# EAGLE design Adapter-CMRI8-RJ45 (EAGLE 7.7.0)
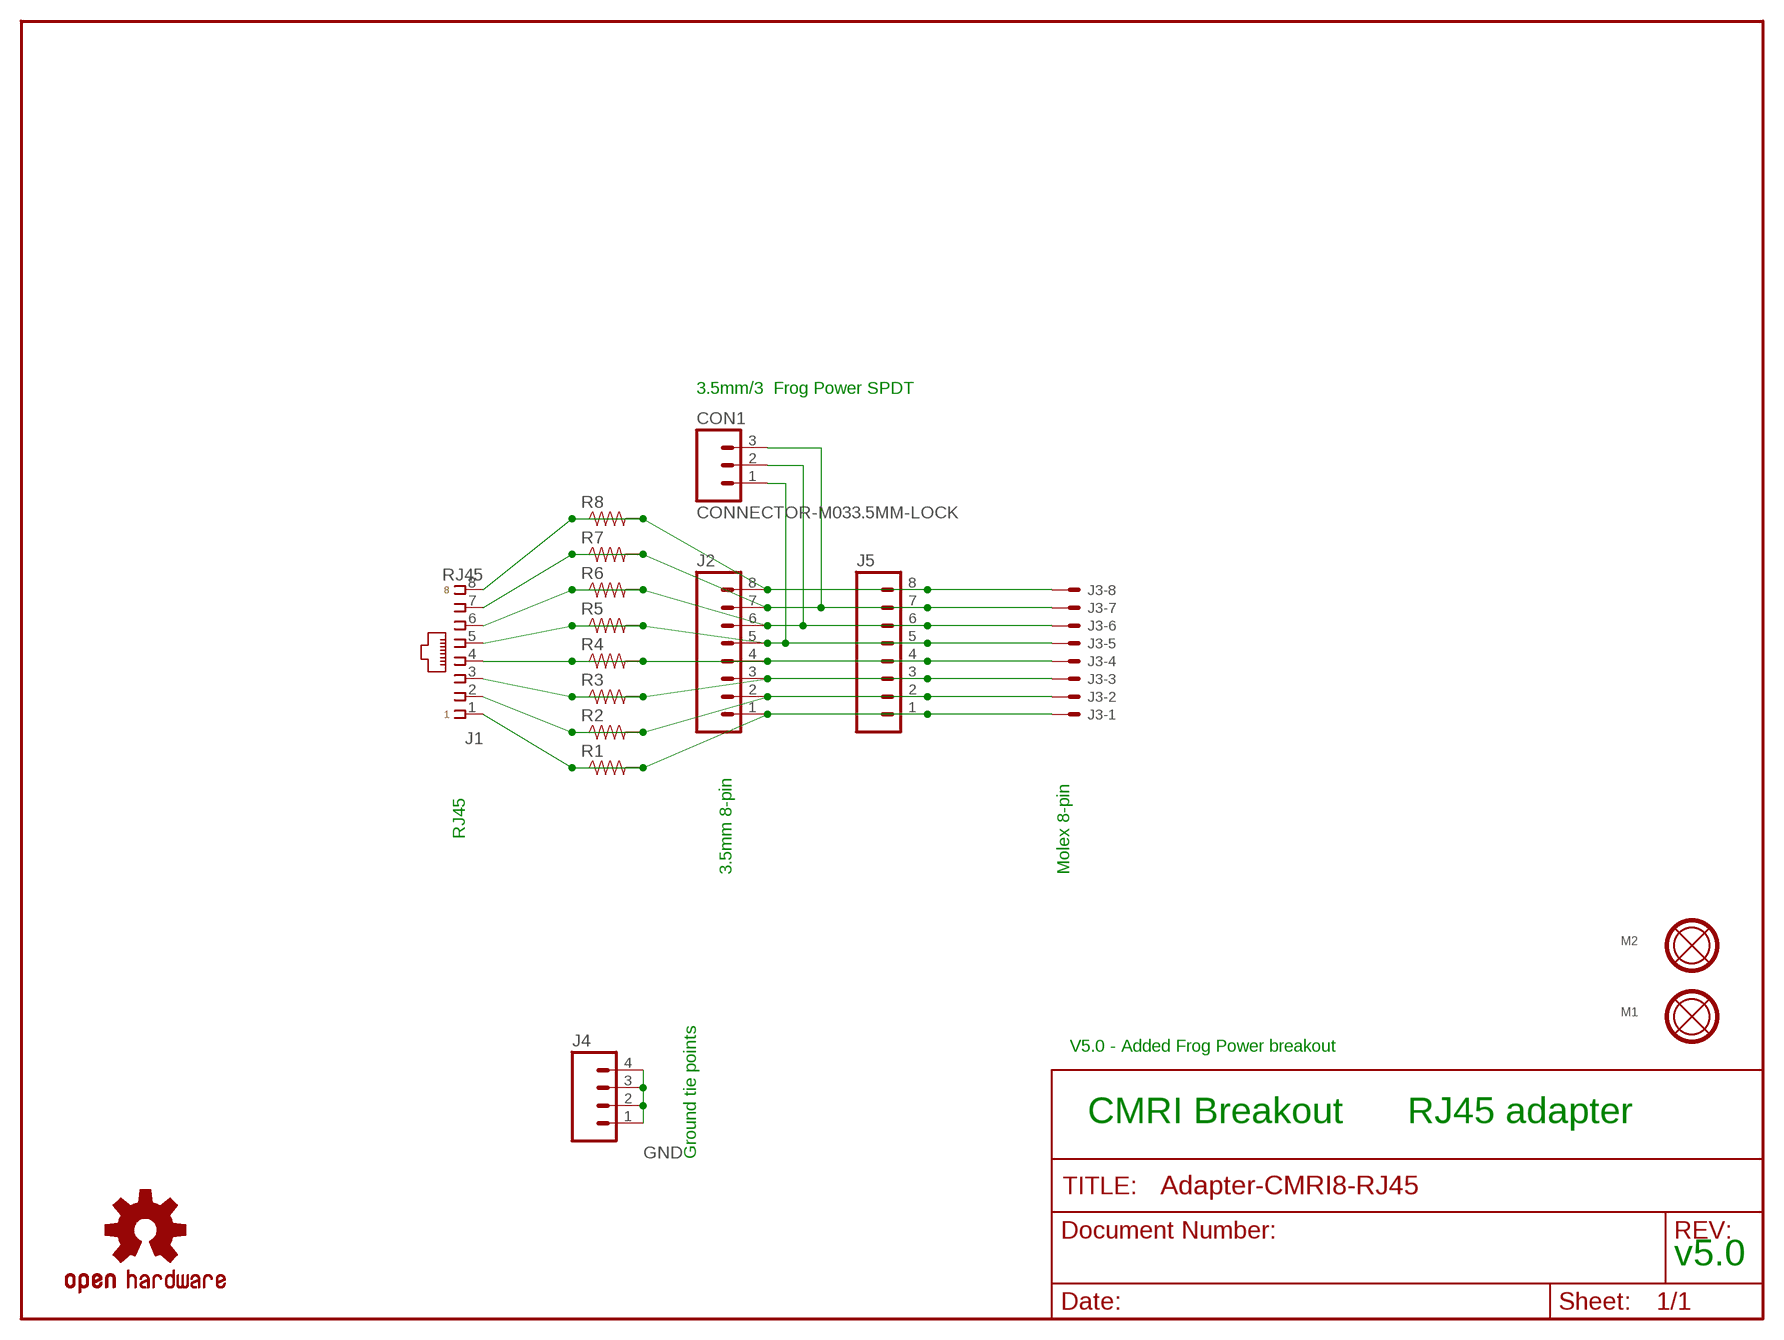
[diagram p0: schematic, sheet 1]

## Parts
CON1  CONNECTOR-M033.5MM-LOCK  [SCREWTERMINAL-3.5MM-3_LOCK.007S]
J1  RJ45  CONNECTOR-RJ45-FRONT  [RJ45-NO-SHIELD]
J2  CONNECTOR-M083.5MM-8  [SCREWTERMINAL-3.5MM-8]
J3  KK-156-8F  [KK-156-8-F]
J4  CONNECTOR-M04SCREW_LOCK  [SCREWTERMINAL-3.5MM-4_LOCK]
J5  CONNECTOR-M08LOCK  [1X08_LOCK]
M1  MOUNTINGHOLE  [MOUNTINGHOLE]
M2  MOUNTINGHOLE  [MOUNTINGHOLE]
R1  RPTH04  [AXIAL-0.4-RES]
R2  RPTH04  [AXIAL-0.4-RES]
R3  RPTH04  [AXIAL-0.4-RES]
R4  RPTH04  [AXIAL-0.4-RES]
R5  RPTH04  [AXIAL-0.4-RES]
R6  RPTH04  [AXIAL-0.4-RES]
R7  RPTH04  [AXIAL-0.4-RES]
R8  RPTH04  [AXIAL-0.4-RES]
U$1  DOC-OSHW-LOGO-L  [OSHW-LOGO-L]

## Nets
GND: J4.1 J4.2 J4.3 J4.4
L1: J1.1 J2.1 J3.1 J5.1 R1.P$1 R1.P$2
L2: J1.2 J2.2 J3.2 J5.2 R2.P$1 R2.P$2
L3: J1.3 J2.3 J3.3 J5.3 R3.P$1 R3.P$2
L4: J1.4 J2.4 J3.4 J5.4 R4.P$1 R4.P$2
L5: CON1.1 J1.5 J2.5 J3.5 J5.5 R5.P$1 R5.P$2
L6: CON1.2 J1.6 J2.6 J3.6 J5.6 R6.P$1 R6.P$2
L7: CON1.3 J1.7 J2.7 J3.7 J5.7 R7.P$1 R7.P$2
L8: J1.8 J2.8 J3.8 J5.8 R8.P$1 R8.P$2

## Notes on the sheet
- 3.5mm/3  Frog Power SPDT
- RJ45
- 3.5mm 8-pin | Molex 8-pin
- V5.0 - Added Frog Power breakout
- CMRI Breakout | RJ45 adapter
- Ground tie points
- v5.0

## Library data of the parts
CON1 = SPCoast:CONNECTOR-M03
J1 = SPCoast:CONNECTOR-RJ45: CORCOM Modular RJ Jacks No Shield Source: www.tycoelectronics.com .. ENG_DS_1654001_1099_RJ_L_0507.pdf; AMP: 520151-4; OPL: none
J2 J5 = SPCoast:CONNECTOR-M08: Header 8 Standard 8-pin 0.1" header. Use with straight break away headers (SKU : PRT-00116), right angle break away headers (PRT-00553), swiss pins (PRT-00743), machine pins (PRT-00117), and female headers (PRT-00115).
J3 = SPCoast:KK-156-8: KK 156 HEADER Source: http://www.molex.com/pdm_docs/sd/026604100_sd.pdf; OC_FARNELL: unknown; OC_NEWARK: unknown
J4 = SPCoast:CONNECTOR-M04: Header 4 Standard 4-pin 0.1" header. Use with straight break away headers (SKU : PRT-00116), right angle break away headers (PRT-00553), swiss pins (PRT-00743), machine pins (PRT-00117), and female headers (PRT-00115). Molex polarized connector foot print use with SKU : PRT-08231 with associated crimp pins and housings. 1MM SMD Version SKU: PRT-10208
M1 M2 = SPCoast:MOUNTINGHOLE: Mounting hole with top and bottom copper and stop rings
R1-R8 = SPCoast:R*: Resistor Basic schematic elements and footprints for 0603, 1206, and PTH 1/10th watt (small) resistors.
U$1 = SPCoast:DOC-OSHW-LOGO-: Open Source Hardware Logo This logo indicates the piece of hardware it is found on incorporates a OSHW license and/or adheres to the definition of open source hardware http://freedomdefined.org/OSHW Creative Commons - Attribution - ShareAlike 3.0

## Net classes
0 default: width 0.254 mm

## Board
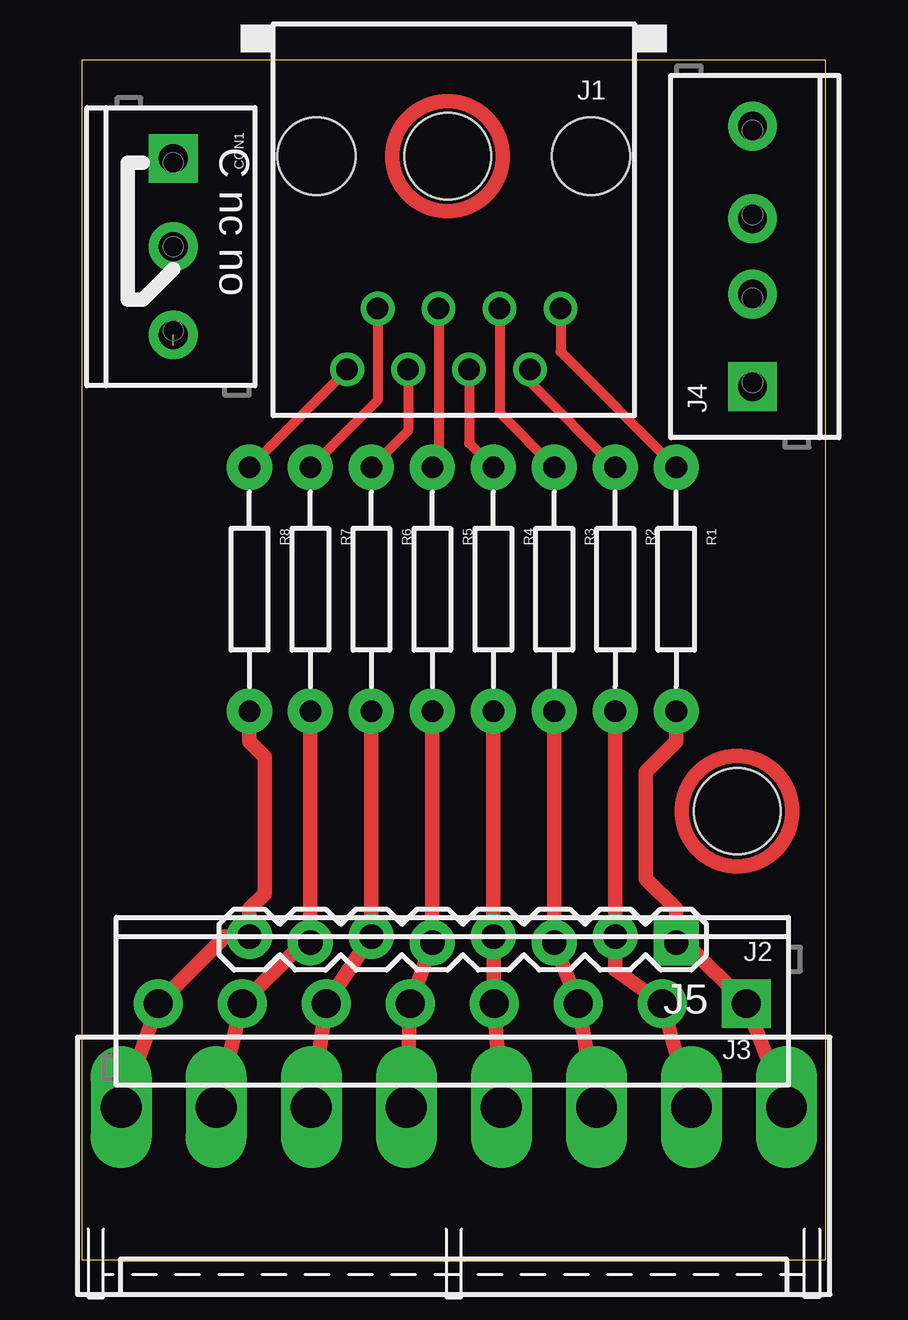
[diagram p1: board, top side]
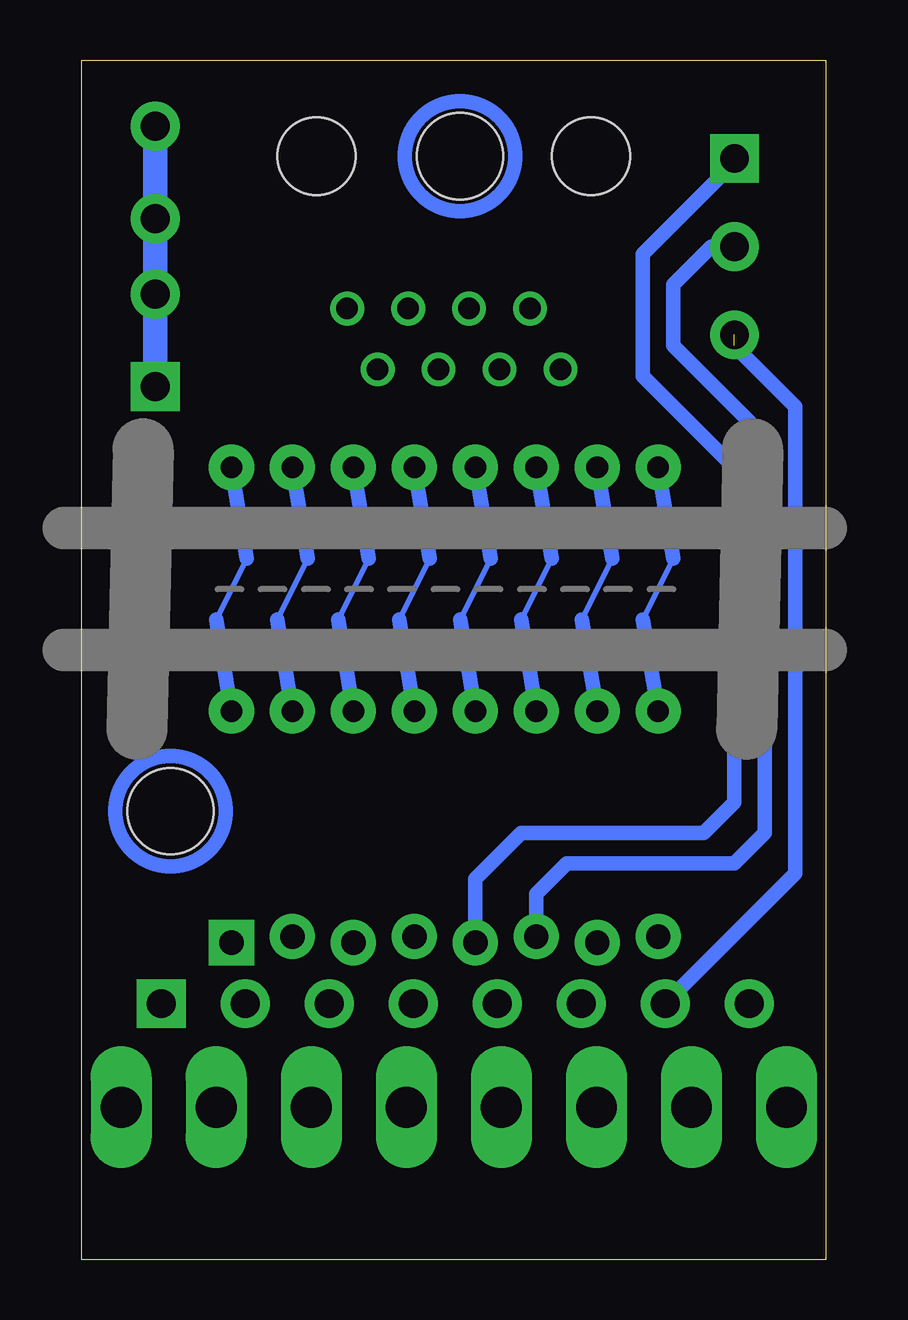
[diagram p2: board, bottom side, seen from below]

Size 31 x 50 mm. Coordinates in mm from the lower left corner, seen from the top.
Outline: 0,0 31,0 31,50 0,50 0,0
Copper layers (1*16): Top 0.035mm / dielectric 1.5mm / Bottom 0.035mm
Design rules "Fusion_eagle_rule_v1.1": minimum track width 6mil, minimum drill 12mil, track to track 6mil, track to pad 6mil, pad to pad 6mil, via to via 6mil, smd to smd 0mil, copper to edge 10mil, drill to drill 10mil, minimum pad ring 10mil, minimum via ring 6mil, stop-mask expansion 2mil, vias tented up to drill 100mil, thermal gap 10mil

### Footprints (pad centres in the part's own frame; a part is rotated, then mirrored left to right if it is on the bottom)
SCREWTERMINAL-3.5MM-3_LOCK.007S = drill 1.2 pad 2.032 square: 1 -0.178,0 | drill 1.2 pad 2.032: 2 3.5,0; 3 7.178,0
RJ45-NO-SHIELD = drill 0.9 pad 1.4: 1 -4.445,6.35; 2 -3.175,8.89; 3 -1.905,6.35; 4 -0.635,8.89; 5 0.635,6.35; 6 1.905,8.89; 7 3.175,6.35; 8 4.445,8.89 | hole 3.251: -5.715,0; 5.715,0
SCREWTERMINAL-3.5MM-8 = drill 1.2 pad 2.032 square: 1 0,0 | drill 1.2 pad 2.032: 2 3.5,0; 3 7,0; 4 10.5,0; 5 14,0; 6 17.5,0; 7 21,0; 8 24.5,0
KK-156-8-F = drill 1.7 pad 2.184 long: 1 -13.86,0; 2 -9.9,0; 3 -5.94,0; 4 -1.98,0; 5 1.98,0; 6 5.94,0; 7 9.9,0; 8 13.86,0
SCREWTERMINAL-3.5MM-4_LOCK = drill 1.2 pad 2.032 square: 1 -0.178,0 | drill 1.2 pad 2.032: 2 3.678,0; 3 6.822,0; 4 10.678,0
1X08_LOCK = drill 1.016 pad 1.88 square: 1 0,0.127 | drill 1.016 pad 1.88: 2 2.54,-0.127; 3 5.08,0.127; 4 7.62,-0.127; 5 10.16,0.127; 6 12.7,-0.127; 7 15.24,0.127; 8 17.78,-0.127
MOUNTINGHOLE = hole 3.6: 0,0
AXIAL-0.4-RES = drill 0.9 pad 1.88: P$1 -5.08,0; P$2 5.08,0

### Placement (x,y rotation side)
CON1  3.81,45.72 270 top
J1  15.5,45.99 180 top
J2  27.69,10.67 180 top
J3  15.5,6.35 180 top
J4  27.94,36.56 90 top
J5  24.77,13.34 180 top
M1  15.24,45.99 0 top
M2  27.3,18.68 0 top
R1  24.77,27.94 270 top
R2  22.23,27.94 270 top
R3  19.68,27.94 270 top
R4  17.14,27.94 270 top
R5  14.61,27.94 270 top
R6  12.06,27.94 270 top
R7  9.53,27.94 270 top
R8  6.99,27.94 270 top
U$1  15.24,45.99 0 top

### Tracks (layer width: path | path; a pad name or v marks a point on that pad's centre or on a via)
GND
  Bottom 1.016: J4.1 J4.2 J4.3 J4.4
L1
  Top 0.406: J1.1 19.95,37.84 R1.P$1
  Top 0.61: J3.1 J2.1 25.15,13.21 J5.1 24.77,14.61 23.5,15.88 23.5,20.32 24.77,21.59 R1.P$2
  Bottom 0.254: 24.13,29.21 25.4,26.67
  Bottom 0.61: R1.P$1 24.13,29.21 | R1.P$2 25.4,26.67
L2
  Top 0.406: J1.2 18.68,36.57 R2.P$1
  Top 0.61: J3.2 J2.2 22.23,12.06 J5.2 R2.P$2
  Bottom 0.254: 21.59,29.21 22.86,26.67
  Bottom 0.61: R2.P$1 21.59,29.21 | R2.P$2 22.86,26.67
L3
  Top 0.406: J1.3 17.41,35.3 R3.P$1
  Top 0.61: J3.3 J2.3 19.94,12.55 | J5.3 19.94,12.55 | R3.P$2 19.68,12.81 19.94,12.55
  Bottom 0.254: 19.05,29.21 20.32,26.67
  Bottom 0.61: R3.P$1 19.05,29.21 | R3.P$2 20.32,26.67
L4
  Top 0.406: J1.4 16.14,34.03 R4.P$1
  Top 0.61: J3.4 J2.4 J5.4 R4.P$2
  Bottom 0.254: 16.51,29.21 17.78,26.67
  Bottom 0.61: R4.P$1 16.51,29.21 | R4.P$2 17.78,26.67
L5
  Top 0.406: J1.5 14.87,33.28 R5.P$1
  Top 0.61: J3.5 J2.5 J5.5 R5.P$2
  Bottom 0.254: 13.97,29.21 15.24,26.67
  Bottom 0.61: R5.P$1 13.97,29.21 | R5.P$2 15.24,26.67 | CON1.1 3.81,45.72 7.62,41.91 7.62,36.83 3.81,33.02 3.81,19.05 5.08,17.78 12.7,17.78 14.61,15.88 J5.5
L6
  Top 0.406: J1.6 13.6,34.55 R6.P$1
  Top 0.61: J3.6 J2.6 J5.6 R6.P$2
  Bottom 0.254: 11.43,29.21 12.7,26.67
  Bottom 0.61: R6.P$1 11.43,29.21 | R6.P$2 12.7,26.67 | J5.6 12.06,15.24 10.79,16.51 3.81,16.51 2.54,17.78 2.54,34.29 6.35,38.1 6.35,40.64 4.77,42.22 CON1.2
L7  (1 unrouted)
  Top 0.406: J1.7 12.32,35.82 R7.P$1
  Top 0.61: J3.7 J2.7 9.23,13.21 J5.7 R7.P$2
  Bottom 0.254: 8.89,29.21 10.16,26.67
  Bottom 0.61: R7.P$1 8.89,29.21 | R7.P$2 10.16,26.67 | 3.81,38.1 1.27,35.56 1.27,16.08 J2.7
L8
  Top 0.406: J1.8 R8.P$1
  Top 0.61: J3.8 J2.8 5.98,13.46 J5.8 6.99,14.61 7.62,15.24 7.62,20.95 6.99,21.59 R8.P$2
  Bottom 0.254: 6.35,29.21 7.62,26.67
  Bottom 0.61: R8.P$1 6.35,29.21 | R8.P$2 7.62,26.67

### Text on the board
tPlace: C nc no
tDocu: COMMON | Cut on / reverse for / Resistors | RJ45 | Breakout | 8 | 1 | 2020.06 | v5.0 | 0.100 | 3.5mm | 8 | 1 | 0.156
bDocu: Solder / Side | SPCoast | MRCS | RJ45 | COMMON | Frog Pwr | Tie points | no nc C | CMRI Accessory | Breakout | Go Bears! | Model Railroading is fun! | www . SPCoast . com | Made in the PCR, Coast Division, NMRA
_tNames: J1 | CON1 | J4 | R8 | R7 | R6 | R5 | R4 | R3 | R2 | R1 | J5 | J2 | J3